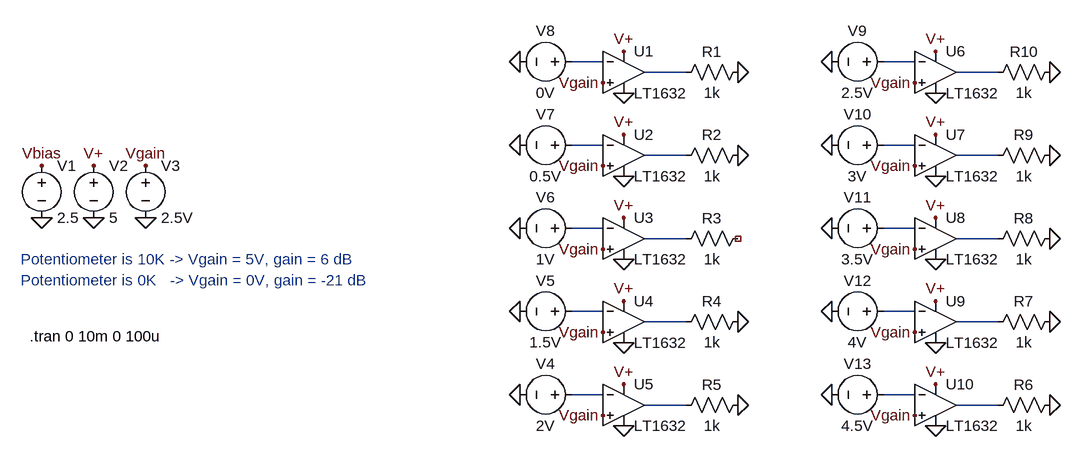
[diagram p0: schematic GaintoDB.asc]
GaintoDB.asc, the LTspice schematic file:
Version 4
SHEET 1 1476 680
WIRE 496 -48 448 -48
WIRE 976 -48 928 -48
WIRE 624 -32 560 -32
WIRE 1104 -32 1040 -32
WIRE 496 80 448 80
WIRE 976 80 928 80
WIRE 624 96 560 96
WIRE 1104 96 1040 96
WIRE 496 208 448 208
WIRE 976 208 928 208
WIRE 624 224 560 224
WIRE 1104 224 1040 224
WIRE 496 336 448 336
WIRE 976 336 928 336
WIRE 624 352 560 352
WIRE 1104 352 1040 352
WIRE 496 464 448 464
WIRE 976 464 928 464
WIRE 624 480 560 480
WIRE 1104 480 1040 480
FLAG -288 192 0
FLAG -368 192 0
FLAG -208 192 0
FLAG -368 112 Vbias
FLAG -288 112 V+
FLAG -208 112 Vgain
FLAG 528 0 0
FLAG 528 128 0
FLAG 528 256 0
FLAG 528 384 0
FLAG 528 512 0
FLAG 528 -64 V+
FLAG 528 64 V+
FLAG 528 192 V+
FLAG 528 320 V+
FLAG 528 448 V+
FLAG 1008 0 0
FLAG 1008 128 0
FLAG 1008 256 0
FLAG 1008 384 0
FLAG 1008 512 0
FLAG 1008 -64 V+
FLAG 1008 64 V+
FLAG 1008 192 V+
FLAG 1008 320 V+
FLAG 1008 448 V+
FLAG 368 -48 0
FLAG 368 80 0
FLAG 368 208 0
FLAG 368 336 0
FLAG 368 464 0
FLAG 848 -48 0
FLAG 848 80 0
FLAG 848 208 0
FLAG 848 336 0
FLAG 848 464 0
FLAG 496 -16 Vgain
FLAG 496 112 Vgain
FLAG 496 240 Vgain
FLAG 496 368 Vgain
FLAG 496 496 Vgain
FLAG 976 -16 Vgain
FLAG 976 112 Vgain
FLAG 976 240 Vgain
FLAG 976 368 Vgain
FLAG 976 496 Vgain
FLAG 704 -32 0
FLAG 704 96 0
FLAG 704 352 0
FLAG 704 480 0
FLAG 1184 480 0
FLAG 1184 352 0
FLAG 1184 224 0
FLAG 1184 96 0
FLAG 1184 -32 0
SYMBOL voltage -368 96 R0
WINDOW 123 0 0 Left 0
WINDOW 39 0 0 Left 0
SYMATTR InstName V1
SYMATTR Value 2.5
SYMBOL voltage -288 96 R0
WINDOW 123 0 0 Left 0
WINDOW 39 0 0 Left 0
SYMATTR InstName V2
SYMATTR Value 5
SYMBOL voltage -208 96 R0
WINDOW 123 0 0 Left 0
WINDOW 39 0 0 Left 0
SYMATTR InstName V3
SYMATTR Value 2.5V
SYMBOL Opamps\\LT1632 528 -96 R0
SYMATTR InstName U1
SYMBOL Opamps\\LT1632 528 32 R0
SYMATTR InstName U2
SYMBOL Opamps\\LT1632 528 160 R0
SYMATTR InstName U3
SYMBOL Opamps\\LT1632 528 288 R0
SYMATTR InstName U4
SYMBOL Opamps\\LT1632 528 416 R0
SYMATTR InstName U5
SYMBOL Opamps\\LT1632 1008 -96 R0
SYMATTR InstName U6
SYMBOL Opamps\\LT1632 1008 32 R0
SYMATTR InstName U7
SYMBOL Opamps\\LT1632 1008 160 R0
SYMATTR InstName U8
SYMBOL Opamps\\LT1632 1008 288 R0
SYMATTR InstName U9
SYMBOL Opamps\\LT1632 1008 416 R0
SYMATTR InstName U10
SYMBOL voltage 464 464 R90
WINDOW 0 -32 56 VBottom 2
WINDOW 3 32 56 VTop 2
WINDOW 123 0 0 Left 0
WINDOW 39 0 0 Left 0
SYMATTR InstName V4
SYMATTR Value 2V
SYMBOL voltage 464 336 R90
WINDOW 0 -32 56 VBottom 2
WINDOW 3 32 56 VTop 2
WINDOW 123 0 0 Left 0
WINDOW 39 0 0 Left 0
SYMATTR InstName V5
SYMATTR Value 1.5V
SYMBOL voltage 464 208 R90
WINDOW 0 -32 56 VBottom 2
WINDOW 3 32 56 VTop 2
WINDOW 123 0 0 Left 0
WINDOW 39 0 0 Left 0
SYMATTR InstName V6
SYMATTR Value 1V
SYMBOL voltage 464 80 R90
WINDOW 0 -32 56 VBottom 2
WINDOW 3 32 56 VTop 2
WINDOW 123 0 0 Left 0
WINDOW 39 0 0 Left 0
SYMATTR InstName V7
SYMATTR Value 0.5V
SYMBOL voltage 464 -48 R90
WINDOW 0 -32 56 VBottom 2
WINDOW 3 32 56 VTop 2
WINDOW 123 0 0 Left 0
WINDOW 39 0 0 Left 0
SYMATTR InstName V8
SYMATTR Value 0V
SYMBOL voltage 944 -48 R90
WINDOW 0 -32 56 VBottom 2
WINDOW 3 32 56 VTop 2
WINDOW 123 0 0 Left 0
WINDOW 39 0 0 Left 0
SYMATTR InstName V9
SYMATTR Value 2.5V
SYMBOL voltage 944 80 R90
WINDOW 0 -32 56 VBottom 2
WINDOW 3 32 56 VTop 2
WINDOW 123 0 0 Left 0
WINDOW 39 0 0 Left 0
SYMATTR InstName V10
SYMATTR Value 3V
SYMBOL voltage 944 208 R90
WINDOW 0 -32 56 VBottom 2
WINDOW 3 32 56 VTop 2
WINDOW 123 0 0 Left 0
WINDOW 39 0 0 Left 0
SYMATTR InstName V11
SYMATTR Value 3.5V
SYMBOL voltage 944 336 R90
WINDOW 0 -32 56 VBottom 2
WINDOW 3 32 56 VTop 2
WINDOW 123 0 0 Left 0
WINDOW 39 0 0 Left 0
SYMATTR InstName V12
SYMATTR Value 4V
SYMBOL voltage 944 464 R90
WINDOW 0 -32 56 VBottom 2
WINDOW 3 32 56 VTop 2
WINDOW 123 0 0 Left 0
WINDOW 39 0 0 Left 0
SYMATTR InstName V13
SYMATTR Value 4.5V
SYMBOL res 720 -48 R90
WINDOW 0 0 56 VBottom 2
WINDOW 3 32 56 VTop 2
SYMATTR InstName R1
SYMATTR Value 1k
SYMBOL res 720 80 R90
WINDOW 0 0 56 VBottom 2
WINDOW 3 32 56 VTop 2
SYMATTR InstName R2
SYMATTR Value 1k
SYMBOL res 720 208 R90
WINDOW 0 0 56 VBottom 2
WINDOW 3 32 56 VTop 2
SYMATTR InstName R3
SYMATTR Value 1k
SYMBOL res 720 336 R90
WINDOW 0 0 56 VBottom 2
WINDOW 3 32 56 VTop 2
SYMATTR InstName R4
SYMATTR Value 1k
SYMBOL res 720 464 R90
WINDOW 0 0 56 VBottom 2
WINDOW 3 32 56 VTop 2
SYMATTR InstName R5
SYMATTR Value 1k
SYMBOL res 1200 464 R90
WINDOW 0 0 56 VBottom 2
WINDOW 3 32 56 VTop 2
SYMATTR InstName R6
SYMATTR Value 1k
SYMBOL res 1200 336 R90
WINDOW 0 0 56 VBottom 2
WINDOW 3 32 56 VTop 2
SYMATTR InstName R7
SYMATTR Value 1k
SYMBOL res 1200 208 R90
WINDOW 0 0 56 VBottom 2
WINDOW 3 32 56 VTop 2
SYMATTR InstName R8
SYMATTR Value 1k
SYMBOL res 1200 80 R90
WINDOW 0 0 56 VBottom 2
WINDOW 3 32 56 VTop 2
SYMATTR InstName R9
SYMATTR Value 1k
SYMBOL res 1200 -48 R90
WINDOW 0 0 56 VBottom 2
WINDOW 3 32 56 VTop 2
SYMATTR InstName R10
SYMATTR Value 1k
TEXT -400 256 Left 2 ;Potentiometer is 10K -> Vgain = 5V, gain = 6 dB
TEXT -400 288 Left 2 ;Potentiometer is 0K   -> Vgain = 0V, gain = -21 dB
TEXT -386 374 Left 2 !.tran 0 10m 0 100u

The netlist it stands for:
* GaintoDB.asc
V1 Vbias 0 2.5
V2 V+ 0 5
V3 Vgain 0 2.5V
XU1 Vgain N001 V+ 0 N003 LT1632  ; pins In+ In- V+ V- OUT
XU2 Vgain N005 V+ 0 N007 LT1632  ; pins In+ In- V+ V- OUT
XU3 Vgain N009 V+ 0 N011 LT1632  ; pins In+ In- V+ V- OUT
XU4 Vgain N013 V+ 0 N015 LT1632  ; pins In+ In- V+ V- OUT
XU5 Vgain N017 V+ 0 N019 LT1632  ; pins In+ In- V+ V- OUT
XU6 Vgain N002 V+ 0 N004 LT1632  ; pins In+ In- V+ V- OUT
XU7 Vgain N006 V+ 0 N008 LT1632  ; pins In+ In- V+ V- OUT
XU8 Vgain N010 V+ 0 N012 LT1632  ; pins In+ In- V+ V- OUT
XU9 Vgain N014 V+ 0 N016 LT1632  ; pins In+ In- V+ V- OUT
XU10 Vgain N018 V+ 0 N020 LT1632  ; pins In+ In- V+ V- OUT
V4 N017 0 2V
V5 N013 0 1.5V
V6 N009 0 1V
V7 N005 0 0.5V
V8 N001 0 0V
V9 N002 0 2.5V
V10 N006 0 3V
V11 N010 0 3.5V
V12 N014 0 4V
V13 N018 0 4.5V
R1 0 N003 1k
R2 0 N007 1k
R3 NC_01 N011 1k
R4 0 N015 1k
R5 0 N019 1k
R6 0 N020 1k
R7 0 N016 1k
R8 0 N012 1k
R9 0 N008 1k
R10 0 N004 1k
* Potentiometer is 10K -> Vgain = 5V, gain = 6 dB
* Potentiometer is 0K   -> Vgain = 0V, gain = -21 dB
.tran 0 10m 0 100u
.lib LTC.lib
.backanno
.end